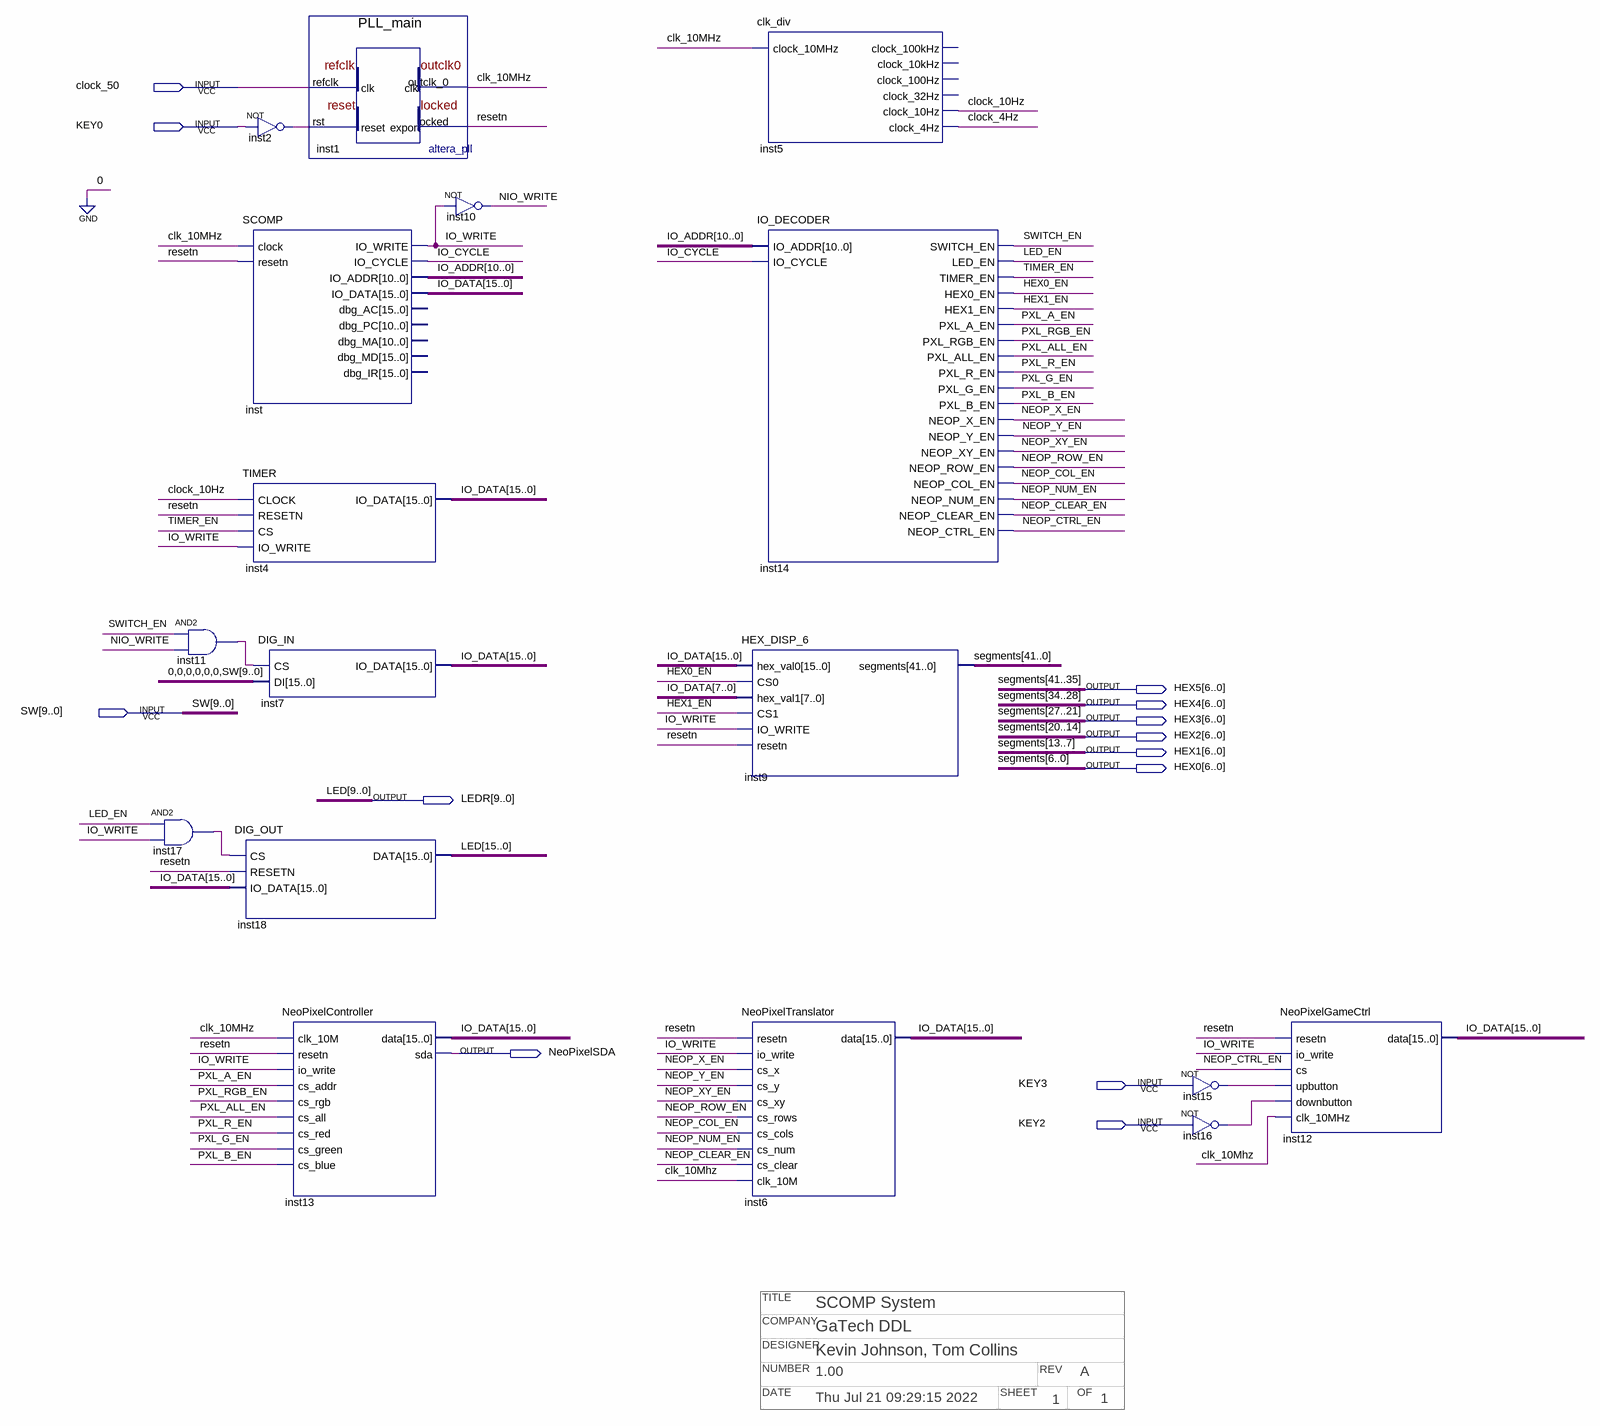
[diagram p0: schematic sheet]
// Quartus schematic SCOMP_System.bdf as structural Verilog: 17 symbols, 13 pins
// Title block: COMPANY: GaTech DDL; DATE: Thu Jul 21 09:29:15 2022; DESIGNER: Kevin Johnson, Tom Collins; NUMBER: 1.00; OF: 1; REV: A; SHEET: 1; TITLE: SCOMP System
module SCOMP_System (
  input  clock_50,
  input  KEY0,
  input  [9:0] SW,
  input  KEY3,
  input  KEY2,
  output [6:0] HEX5,
  output [6:0] HEX4,
  output [6:0] HEX3,
  output [6:0] HEX2,
  output [6:0] HEX1,
  output [6:0] HEX0,
  output [9:0] LEDR,
  output NeoPixelSDA
);

  wire clk_10MHz, clock_4Hz, clock_10Hz, HEX0_EN, HEX1_EN, inst2_out, inst11_out, inst15_out, inst16_out,
       inst17_out, IO_CYCLE, IO_WRITE, LED_EN, NEOP_CLEAR_EN, NEOP_COL_EN, NEOP_CTRL_EN, NEOP_NUM_EN,
       NEOP_ROW_EN, NEOP_X_EN, NEOP_XY_EN, NEOP_Y_EN, NIO_WRITE, PXL_A_EN, PXL_ALL_EN, PXL_B_EN, PXL_G_EN,
       PXL_R_EN, PXL_RGB_EN, resetn, SWITCH_EN, TIMER_EN;
  wire [10:0] IO_ADDR;
  wire [15:0] IO_DATA;
  wire [15:10] LED;

  and inst17 (inst17_out, LED_EN, IO_WRITE);
  and inst11 (inst11_out, SWITCH_EN, NIO_WRITE);
  not inst2 (inst2_out, KEY0);
  SCOMP inst (
    .clock(clk_10MHz), .resetn(resetn), .IO_WRITE(IO_WRITE), .IO_CYCLE(IO_CYCLE), .IO_ADDR(IO_ADDR),
    .IO_DATA(IO_DATA));  // open: dbg_AC, dbg_PC, dbg_MA, dbg_MD, dbg_IR
  TIMER inst4 (.CLOCK(clock_10Hz), .RESETN(resetn), .CS(TIMER_EN), .IO_WRITE(IO_WRITE), .IO_DATA(IO_DATA));
  DIG_IN inst7 (.CS(inst11_out), .DI({{6{1'b0}}, SW}), .IO_DATA(IO_DATA));
  DIG_OUT inst18 (.CS(inst17_out), .RESETN(resetn), .IO_DATA(IO_DATA), .DATA({LED, LEDR}));
  NeoPixelController inst13 (
    .clk_10M(clk_10MHz), .resetn(resetn), .io_write(IO_WRITE), .cs_addr(PXL_A_EN), .cs_rgb(PXL_RGB_EN),
    .cs_all(PXL_ALL_EN), .cs_red(PXL_R_EN), .cs_green(PXL_G_EN), .cs_blue(PXL_B_EN), .sda(NeoPixelSDA),
    .data(IO_DATA));
  PLL_main inst1 (.refclk(clock_50), .rst(inst2_out), .outclk_0(clk_10MHz), .locked(resetn));
  not inst10 (NIO_WRITE, IO_WRITE);
  clk_div inst5 (
    .clock_10MHz(clk_10MHz), .clock_10Hz(clock_10Hz), .clock_4Hz(clock_4Hz));  // open: clock_100kHz, clock_10kHz, clock_100Hz, clock_32Hz
  IO_DECODER inst14 (
    .IO_ADDR(IO_ADDR), .IO_CYCLE(IO_CYCLE), .SWITCH_EN(SWITCH_EN), .LED_EN(LED_EN), .TIMER_EN(TIMER_EN),
    .HEX0_EN(HEX0_EN), .HEX1_EN(HEX1_EN), .PXL_A_EN(PXL_A_EN), .PXL_RGB_EN(PXL_RGB_EN),
    .PXL_ALL_EN(PXL_ALL_EN), .PXL_R_EN(PXL_R_EN), .PXL_G_EN(PXL_G_EN), .PXL_B_EN(PXL_B_EN),
    .NEOP_X_EN(NEOP_X_EN), .NEOP_Y_EN(NEOP_Y_EN), .NEOP_XY_EN(NEOP_XY_EN), .NEOP_ROW_EN(NEOP_ROW_EN),
    .NEOP_COL_EN(NEOP_COL_EN), .NEOP_NUM_EN(NEOP_NUM_EN), .NEOP_CLEAR_EN(NEOP_CLEAR_EN),
    .NEOP_CTRL_EN(NEOP_CTRL_EN));
  HEX_DISP_6 inst9 (
    .hex_val0(IO_DATA), .CS0(HEX0_EN), .hex_val1(IO_DATA[7:0]), .CS1(HEX1_EN), .IO_WRITE(IO_WRITE),
    .resetn(resetn), .segments({HEX5, HEX4, HEX3, HEX2, HEX1, HEX0}));
  NeoPixelTranslator inst6 (
    .resetn(resetn), .io_write(IO_WRITE), .cs_x(NEOP_X_EN), .cs_y(NEOP_Y_EN), .cs_xy(NEOP_XY_EN),
    .cs_rows(NEOP_ROW_EN), .cs_cols(NEOP_COL_EN), .cs_num(NEOP_NUM_EN), .cs_clear(NEOP_CLEAR_EN),
    .clk_10M(clk_10MHz), .data(IO_DATA));
  not inst15 (inst15_out, KEY3);
  not inst16 (inst16_out, KEY2);
  NeoPixelGameCtrl inst12 (
    .resetn(resetn), .io_write(IO_WRITE), .cs(NEOP_CTRL_EN), .upbutton(inst15_out), .downbutton(inst16_out),
    .clk_10MHz(clk_10MHz), .data(IO_DATA));

  // Other names for the same wires on the sheet: LED[9:0] = LEDR;
  //   segments[41:0] = {HEX5, HEX4, HEX3, HEX2, HEX1, HEX0}
endmodule
